# Altium schematic sheet 掌控扩展板ASCIII.SchDoc
size A4; SheetNumber: 1; SheetTotal: 1
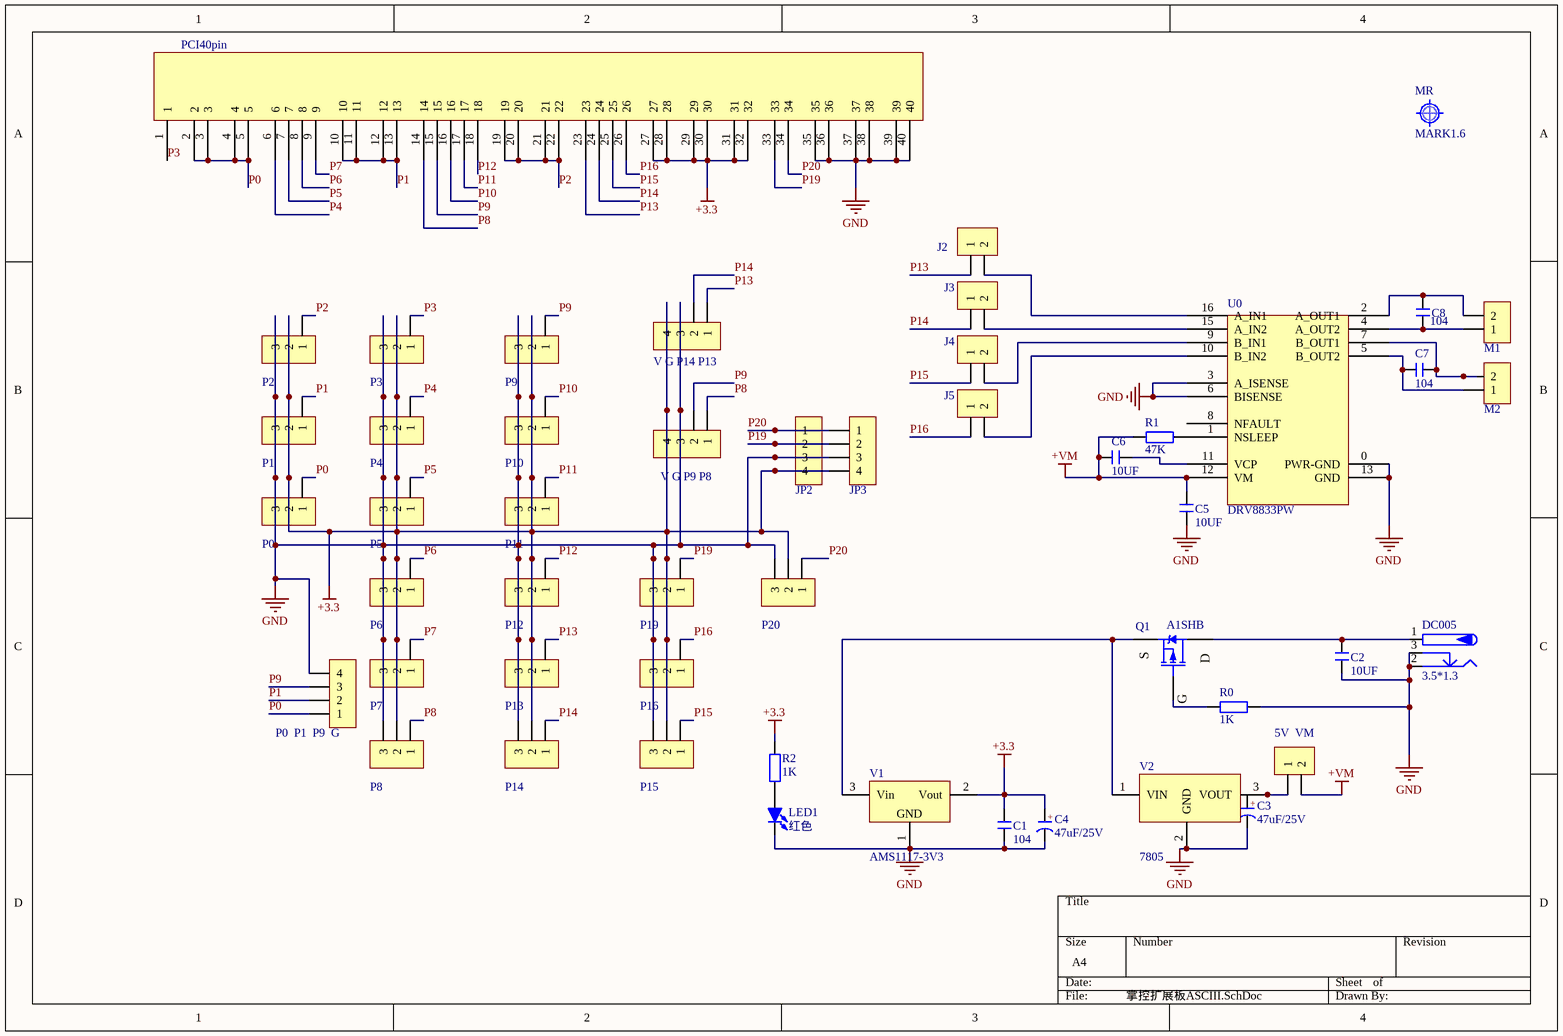
[diagram p0: 掌控扩展板ASCIII.SchDoc]

## Parts
5V_VM  HDR-1X2  [HDR2.54-LI-2P]  (value not drawn)
?  PCI40pin  [PCI40PIN]
C1  104  [C 0603_L]
C2  10UF  [C 0805_L]
C3  47uF/25V  [CM D(6.3*5.4)]
C4  47uF/25V  [CM D(6.3*5.4)]
C5  10UF  [C 0805_L]
C6  10UF  [C 0805_L]
C7  104  [C 0603_L]
C8  104  [C 0603_L]
DC005  3.5*1.3  [DC-005]
J2  HDR-1X2  [HDR2.54-LI-2P]  (value not drawn)
J3  HDR-1X2  [HDR2.54-LI-2P]  (value not drawn)
J4  HDR-1X2  [HDR2.54-LI-2P]  (value not drawn)
J5  HDR-1X2  [HDR2.54-LI-2P]  (value not drawn)
JP2  HDR-1X4  [KF2510-LI-4P]  (value not drawn)
JP3  HDR-1X4  [KF2510-LI-4P]  (value not drawn)
LED1  红色  [LED 0603R]
M1  HDR-1X2  [KF2510-LI-2P]  (value not drawn)
M2  HDR-1X2  [KF2510-LI-2P]  (value not drawn)
MR  MARK1.6  [Mark 1]
P0  HDR-1X3  [KF2510-LI-3P]  (value not drawn)
P0_P1_P9_G  HDR-1X4  [KF2510-LI-4P]  (value not drawn)
P1  HDR-1X3  [KF2510-LI-3P]  (value not drawn)
P2  HDR-1X3  [KF2510-LI-3P]  (value not drawn)
P3  HDR-1X3  [KF2510-LI-3P]  (value not drawn)
P4  HDR-1X3  [KF2510-LI-3P]  (value not drawn)
P5  HDR-1X3  [KF2510-LI-3P]  (value not drawn)
P6  HDR-1X3  [KF2510-LI-3P]  (value not drawn)
P7  HDR-1X3  [KF2510-LI-3P]  (value not drawn)
P8  HDR-1X3  [KF2510-LI-3P]  (value not drawn)
P9  HDR-1X3  [KF2510-LI-3P]  (value not drawn)
P10  HDR-1X3  [KF2510-LI-3P]  (value not drawn)
P11  HDR-1X3  [KF2510-LI-3P]  (value not drawn)
P12  HDR-1X3  [KF2510-LI-3P]  (value not drawn)
P13  HDR-1X3  [KF2510-LI-3P]  (value not drawn)
P14  HDR-1X3  [KF2510-LI-3P]  (value not drawn)
P15  HDR-1X3  [KF2510-LI-3P]  (value not drawn)
P16  HDR-1X3  [KF2510-LI-3P]  (value not drawn)
P19  HDR-1X3  [KF2510-LI-3P]  (value not drawn)
P20  HDR-1X3  [KF2510-LI-3P]  (value not drawn)
Q1  A1SHB  [SOT23-3N]
R0  1K  [R 0603_L]
R1  47K  [R 0603_L]
R2  1K  [R 0603_L]
U0  DRV8833PW  [TSSOP16_L]
V1  AMS1117-3V3  [SOT223_N]
V2  7805  [TO252]
V_G_P9_P8  HDR-1X4  [KF2510-LI-4P]  (value not drawn)
V_G_P14_P13  HDR-1X4  [KF2510-LI-4P]  (value not drawn)

## Nets
+3.3: ?.27 ?.28 ?.29 ?.30 ?.31 ?.32 C1.2 C4.1(A) JP2.4 JP3.4 P0.2 P1.2 P2.2 P3.2 P4.2 P5.2 P6.2 P7.2 P8.2 P9.2 P10.2 P11.2 P12.2 P13.2 P14.2 P15.2 P16.2 P19.2 P20.2 R2.2 V1.2(Vout) V_G_P9_P8.4 V_G_P14_P13.4
+VM: 5V_VM.2 C5.2 C6.2 R1.1 U0.12(VM)
GND: ?.35 ?.36 ?.37 ?.38 ?.39 ?.40 C1.1 C2.2 C3.2(K) C4.2(K) C5.1 DC005.2 DC005.3 JP2.3 JP3.3 LED1.2(K) P0.3 P0_P1_P9_G.4 P1.3 P2.3 P3.3 P4.3 P5.3 P6.3 P7.3 P8.3 P9.3 P10.3 P11.3 P12.3 P13.3 P14.3 P15.3 P16.3 P19.3 P20.3 R0.2 U0.0(PWR-GND) U0.3(A_ISENSE) U0.6(BISENSE) U0.13(GND) V1.1(GND) V2.2(GND) V_G_P9_P8.3 V_G_P14_P13.3
P0: ?.2 ?.3 ?.4 ?.5 P0.1 P0_P1_P9_G.1
P1: ?.10 ?.11 ?.12 ?.13 P0_P1_P9_G.2 P1.1
P2: ?.19 ?.20 ?.21 ?.22 P2.1
P3: ?.1 P3.1
P4: ?.6 P4.1
P5: ?.7 P5.1
P6: ?.8 P6.1
P7: ?.9 P7.1
P8: ?.14 P8.1 V_G_P9_P8.1
P9: ?.15 P0_P1_P9_G.3 P9.1 V_G_P9_P8.2
P10: ?.16 P10.1
P11: ?.17 P11.1
P12: ?.18 P12.1
P13: ?.23 J2.1 P13.1 V_G_P14_P13.1
P14: ?.24 J3.1 P14.1 V_G_P14_P13.2
P15: ?.25 J4.1 P15.1
P16: ?.26 J5.1 P16.1
P19: ?.33 JP2.2 JP3.2 P19.1
P20: ?.34 JP2.1 JP3.1 P20.1
Net5V_VM_1: 5V_VM.1 C3.1(A) V2.3(VOUT)
NetC2_1: C2.1 DC005.1 Q1.3(D)
NetC6_1: C6.1 U0.11(VCP)
NetC7_1: C7.1 M2.2 U0.7(B_OUT1)
NetC7_2: C7.2 M2.1 U0.5(B_OUT2)
NetC8_1: C8.1 M1.1 U0.4(A_OUT2)
NetC8_2: C8.2 M1.2 U0.2(A_OUT1)
NetJ2_2: J2.2 U0.16(A_IN1)
NetJ3_2: J3.2 U0.15(A_IN2)
NetJ4_2: J4.2 U0.9(B_IN1)
NetJ5_2: J5.2 U0.10(B_IN2)
NetLED1_1: LED1.1(A) R2.1
NetQ1_1: Q1.1(G) R0.1
NetQ1_2: Q1.2(S) V1.3(Vin) V2.1(VIN)
NetR1_2: R1.2 U0.1(NSLEEP)

Not connected (* = marked no-connect by the designer): U0 8(NFAULT)

## Notes on the sheet
- (in symbol C-CM) +

## Library data of the parts
5V_VM J2-J5 M1 M2 = Header 2: 2P接插件; 版权归属: 源创客; BOM名称: 2P接插件; 学习资源: www.ooocke.com
C1 C2 C5-C8 = C: 无极性贴片电容; 版权归属: 源创客; BOM名称: 无极性贴片电容; 学习资源: www.ooocke.com
C3 C4 = C-CM: 贴片电解电容; 版权归属: 源创客; BOM名称: 贴片电解电容; 学习资源: www.ooocke.com
DC005 = P-DC: 低压电源接口; BOM名称: DC电源接口; 版权归属: 源创客; 学习资源: www.ooocke.com
JP2 JP3 P0_P1_P9_G V_G_P9_P8 V_G_P14_P13 = Header 4: 4P接插件; 版权归属: 源创客; BOM名称: 4P接插件; 学习资源: www.ooocke.com
LED1 = LED-SMD: 贴片LED; 版权归属: 源创客; BOM名称: 贴片LED; 学习资源: www.ooocke.com
MR = MARK: 光学定位点; 版权归属: 源创客; BOM名称: 光学定位点; 学习资源: www.ooocke.com
P0-P16 P19 P20 = Header 3: 3P接插件; 版权归属: 源创客; BOM名称: 3P接插件; 学习资源: www.ooocke.com
Q1 = SI2301: P沟道场效应管; 版权归属: 源创客; BOM名称: P沟道场效应管; 学习资源: www.ooocke.com
R0-R2 = R: 贴片电阻; 版权归属: 源创客; BOM名称: 贴片电阻; 学习资源: www.ooocke.com
V1 = AMS1117: 三端稳压芯片; BOM名称: 稳压芯片; 版权归属: 源创客; 学习资源: www.ooocke.com
V2 = 78xx: 线性稳压芯片; 版权归属: 源创客; BOM名称: 线性稳压芯片; 学习资源: www.ooocke.com